# Altium project Multi Vibrator Circuit.PrjPcb
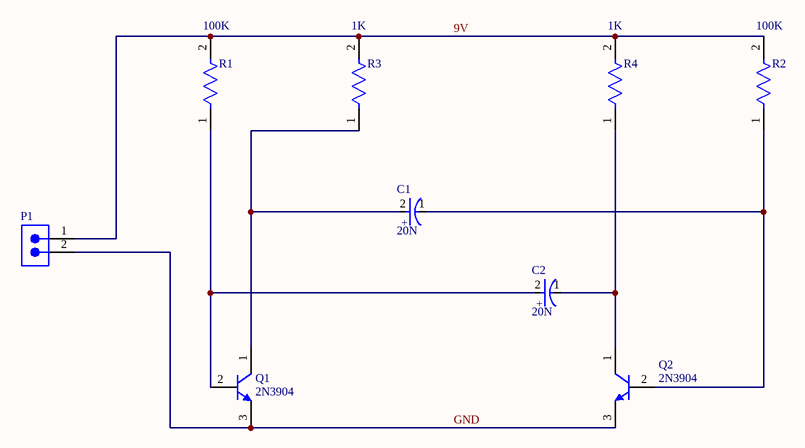
[diagram p0: MultiVibrator.SchDoc]
1 sheet, 9 parts. Net scope: global (net labels, ports and power ports of the same name join across sheets).
Board file: MultiVibrator.PcbDoc

## Sheet MultiVibrator.SchDoc
size A4; SheetNumber: 1; SheetTotal: 1

### Parts
C1  Capacitance: 20N  [FP-600D107G070DL4-MFG]
C2  Capacitance: 20N  [FP-600D107G070DL4-MFG]
P1  61900211121  [61900211121]  (value not drawn)
Q1  2N3904  [ONSC-TO-92-3-29-11]
Q2  2N3904  [ONSC-TO-92-3-29-11]
R1  Resistance: 100K  [FP-MRS25-MFG]
R2  Resistance: 100K  [FP-MRS25-MFG]
R3  Resistance: 1K  [FP-MRS25-MFG]
R4  Resistance: 1K  [FP-MRS25-MFG]

### Nets
9V: P1.1 R1.2 R2.2 R3.2 R4.2
GND: P1.2 Q1.3(E) Q2.3(E)
NetC1_1: C1.1(C) Q2.2(B) R2.1
NetC1_2: C1.2(A) Q1.1(C) R3.1
NetC2_1: C2.1(C) Q2.1(C) R4.1
NetC2_2: C2.2(A) Q1.2(B) R1.1

### Notes on the sheet
- (in symbol CMP-00030-74775681-2) +

### Library data of the parts
C1 C2 = CMP-00030-74775681-2: 600D107G070DL4 Cap Alum 100UF 70V Axial; Polarity: Polar; Life (Hours): 2000hours; Voltage Rating: 70V; Height: 10.71mm; Mount: Through Hole; NexarPartId: 74775681; RoHS: Compliant; Length: 55.5498mm; Min Operating Temperature: -55°C; Case/Package: Axial; Max Operating Temperature: 125°C
P1 = CMP-1502-00584-3: NexarPartId: 18818218; Gender: Male; Connector Type: Male Pin; Insulation Resistance: 1GΩ; Contact Resistance: 20mΩ; Number of Contacts: 2; Operating Supply Voltage: 250V; Current Rating: 3A; Pitch: 2.54mm; Color: Beige; Fastening Type: Friction; Number of Pins: 2; Lead Pitch: 2.54mm; Orientation: Vertical; Max Operating Temperature: 105°C; Contact Mating Length: 7.493mm; RoHS: Compliant; Voltage Rating: 250V; Number of Positions: 2; Mount: Through Hole; Length: 5.08mm; Contact Plating: Tin; Width: 5.12mm; Termination: Through Hole; Flammability Rating: UL94 V-0; Min Operating Temperature: -40°C; Housing Material: Nylon; Contact Gender: Male; Number of Rows: 1; Packaging: Bulk; REACH SVHC: Unknown; Contact Material: Copper; Height: 11.75mm
Q1 Q2 = CMP-1048-01458-1: Amplifier Transistor, NPN Silicon, 3-Pin TO-92, Bulk Box; PartNumber: BC337; Manufacturer: On Semiconductor; Note1: 0; IC Continuous (A): 0.8; ComponentLink1URL: http://www.onsemi.com/; PackageDescription: 3-Pin Transistor Outline, Body 4.825 x 3.685 mm, Pitch 1.27 mm; ComponentLink3URL: http://www.onsemi.cn/pub_link/Collateral/2N6426-D.PDF; ComponentLink1Description: Manufacturer URL; PackageVersion: Rev. AM; Polarity: NPN; PackageReference: TO-92-3-29-11_AM_SL; DatasheetVersion: Rev. 8; ComponentLink2URL: http://www.onsemi.com/pub_link/Collateral/BC337-D.PDF; Packing: Bulk Box; RoHS: FALSE; ComponentLink3Description: Package Specification; Mounting Technology: Through Hole; ComponentLink2Description: Datasheet
R1-R4 = CMP-02408-000052-1: RES 562 OHM 0.6W 1% AXIAL; Lead Diameter: 0.6mm; Max Power Dissipation: 600mW; Voltage Rating: 350V; Temperature Coefficient: 50ppm/°C; RoHS Compliant: Yes; Number of Terminations: 2; Termination: Axial; Series: MRS25; Length: 6.5mm; Mount: Through Hole; Packaging: Tape and Reel; Resistor Type: Thin Film; Radiation Hardening: No; Max Operating Temperature: 155°C; Min Operating Temperature: -55°C; Tolerance: 1%; Contact Plating: Tin; Case/Package: Axial; Package Quantity: 1; Width: 2.5mm; Lead Free: Lead Free; Power Rating: 600mW; Technology: METAL FILM; Diameter: 2.5mm